# Altium schematic sheet SCH_RESETDAY.SchDoc
size A4; SheetNumber: 2; SheetTotal: 3
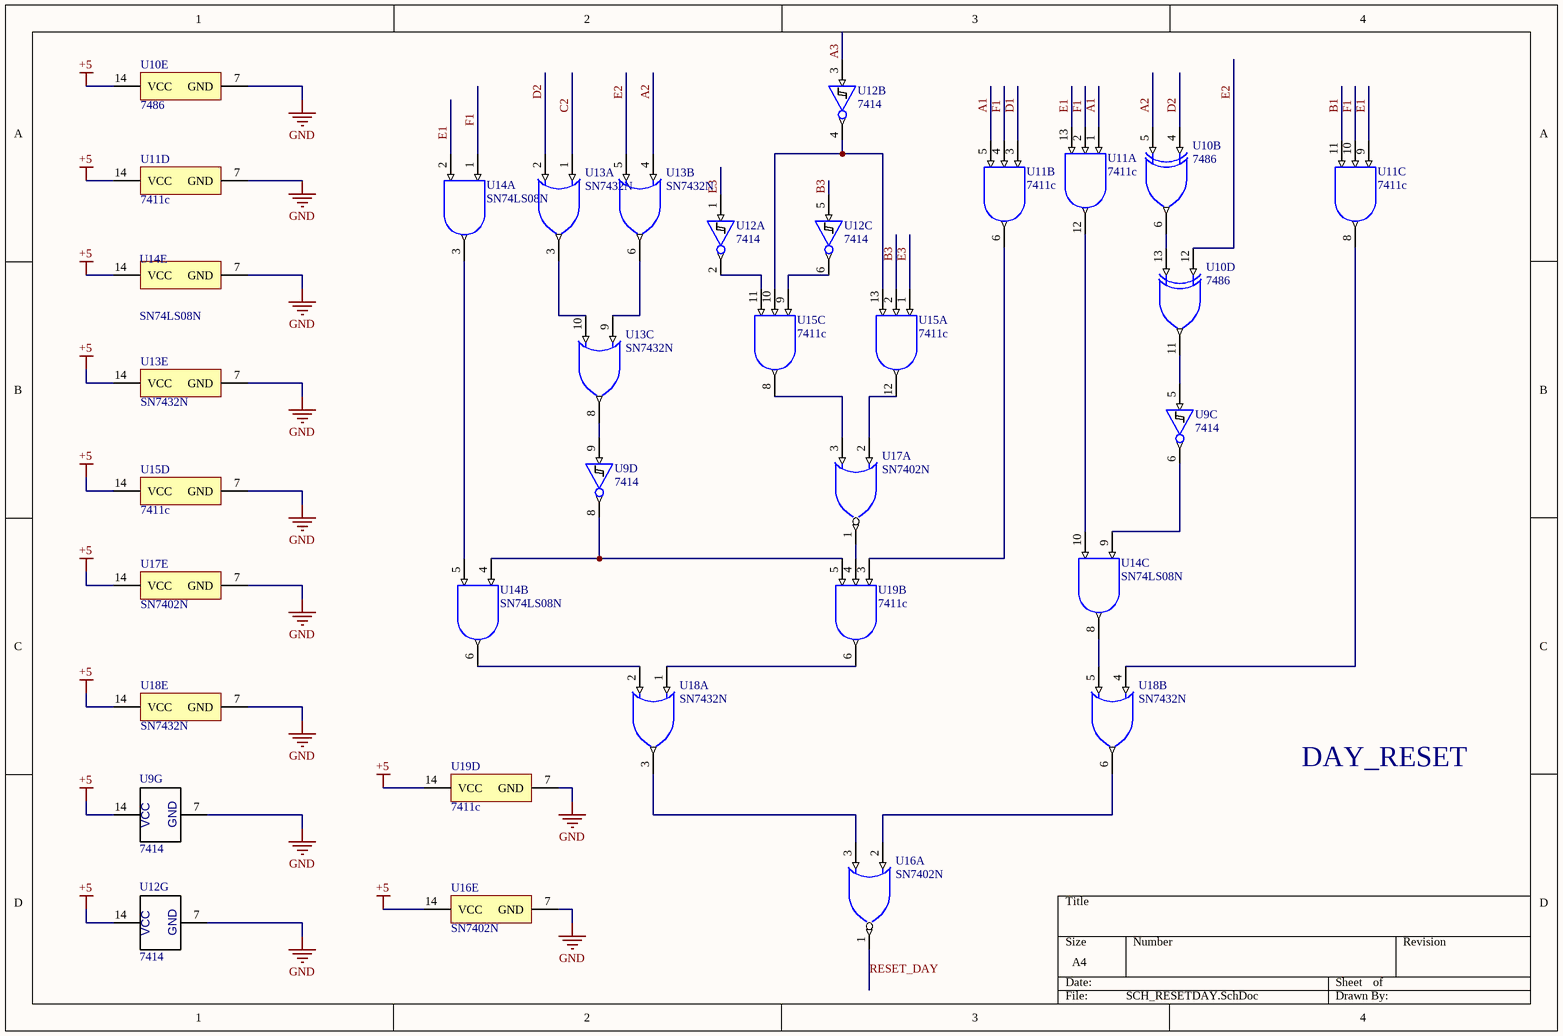
[diagram p0: SCH_RESETDAY.SchDoc]

## Parts
U9  7414  [DIP14]  (parts C,D,G of 7)
U10  7486  [N0014A]  (parts B,D,E of 5)
U11  7411c  [N0014A]  (parts A,B,C,D of 4)
U12  7414  [DIP14]  (parts A,B,C,G of 7)
U13  SN7432N  [N0014A]  (parts A,B,C,E of 5)
U14  SN74LS08N  [N0014A]  (parts A,B,C,E of 5)
U15  7411c  [N0014A]  (parts A,C,D of 4)
U16  SN7402N  [N0014A]  (parts A,E of 5)
U17  SN7402N  [N0014A]  (parts A,E of 5)
U18  SN7432N  [N0014A]  (parts A,B,E of 5)
U19  7411c  [N0014A]  (parts B,D of 4)

## Nets
+5: U9.14(VCC) U10.14(VCC) U11.14(VCC) U12.14(VCC) U13.14(VCC) U14.14(VCC) U15.14(VCC) U16.14(VCC) U17.14(VCC) U18.14(VCC) U19.14(VCC)
GND: U9.7(GND) U10.7(GND) U11.7(GND) U12.7(GND) U13.7(GND) U14.7(GND) U15.7(GND) U16.7(GND) U17.7(GND) U18.7(GND) U19.7(GND)
A1: U11.1(1A) U11.5(2C)
A2: U10.5(2B) U13.4(2A)
A3: U12.3(A)
B1: U11.11(3C)
B3: U12.5(A) U15.2(1B)
C2: U13.1(1A)
D1: U11.3(2A)
D2: U10.4(2A) U13.2(1B)
E1: U11.9(3A) U11.13(1C) U14.2(1B)
E2: U10.12(4A) U13.5(2B)
E3: U12.1(A) U15.1(1A)
F1: U11.2(1B) U11.4(2B) U11.10(3B) U14.1(1A)
RESET_DAY: U16.1(1Y)
NetU9_5: U9.5(A) U10.11(4Y)
NetU9_6: U9.6(Y) U14.9(3A)
NetU9_8: U9.8(Y) U14.4(2A) U19.5(2C)
NetU9_9: U9.9(A) U13.8(3Y)
NetU10_6: U10.6(2Y) U10.13(4B)
NetU11_6: U11.6(2Y) U19.3(2A)
NetU11_8: U11.8(3Y) U18.4(2A)
NetU11_12: U11.12(1Y) U14.10(3B)
NetU12_2: U12.2(Y) U15.11(3C)
NetU12_4: U12.4(Y) U15.10(3B) U15.13(1C)
NetU12_6: U12.6(Y) U15.9(3A)
NetU13_3: U13.3(1Y) U13.10(3B)
NetU13_6: U13.6(2Y) U13.9(3A)
NetU14_3: U14.3(1Y) U14.5(2B)
NetU14_6: U14.6(2Y) U18.2(1B)
NetU14_8: U14.8(3Y) U18.5(2B)
NetU15_8: U15.8(3Y) U17.3(1B)
NetU15_12: U15.12(1Y) U17.2(1A)
NetU16_2: U16.2(1A) U18.6(2Y)
NetU16_3: U16.3(1B) U18.3(1Y)
NetU17_1: U17.1(1Y) U19.4(2B)
NetU18_1: U18.1(1A) U19.6(2Y)

## Notes on the sheet
- DAY_RESET

## Library data of the parts
U9 U12 = 7414: IC, M74HC04M, Hex Inverter, SO-14; Text Field1: ST; Text Field2: M74HC04M1R; Text Field3: Mouser; Text Field4: 511-M74HC04M; Text Field6: .22; Text Field5: SO-14; NI?: *; O?: *; Section:: *
U10 = 7486: High Speed CMOS Logic Quad 2-Input Exclusive-OR Gates, N0014A, TUBE; Manufacturer: Texas Instruments; Generic Part Number: CD74HC86; tpd @ Nom Voltage(Max)(ns): 30; Rating: Catalog; F @ Nom Voltage(Max)(Mhz): 70; VCC(Max)(V): 6; ICC @ Nom Voltage(Max)(mA): 0.02; VCC(Min)(V): 2; Voltage(Nom)(V): 5; Technology Family: HC; Schmitt Trigger: No; Output Drive (IOL/IOH)(Max)(mA): 5.2/-5.2; Bits(#): 4; Output Type: CMOS; DatasheetVersion: SCHS137D; Input Type: CMOS; PackageReference: N0014A; Operating Temperature Range(C): -55 to 125
U11 U15 U19 = 7411c: High Speed CMOS Logic Triple 3-Input AND Gates, N0014A, TUBE; Generic Part Number: CD74HC11; Manufacturer: Texas Instruments; tpd @ Nom Voltage(Max)(ns): 25; VCC(Max)(V): 6; Rating: Catalog; Technology Family: HC; Schmitt Trigger: No; ICC @ Nom Voltage(Max)(mA): 0.02; Bits(#): 3; Voltage(Nom)(V): 5; Output Drive (IOL/IOH)(Max)(mA): -5.2/5.2; VCC(Min)(V): 2; F @ Nom Voltage(Max)(Mhz): 70; DatasheetVersion: SCHS273E; Input Type: CMOS; PackageReference: N0014A; Output Type: CMOS; Operating Temperature Range(C): -55 to 125
U13 U18 = CMP-1573-00140-3: Quad 2-input positive-OR gates, N0014A, TUBE; Manufacturer: Texas Instruments; Generic Part Number: SN7432; VCC(Max)(V): 5.25; Voltage(Nom)(V): 5; VCC(Min)(V): 4.75; F @ Nom Voltage(Max)(Mhz): 100; Output Type: TTL; Output Drive (IOL/IOH)(Max)(mA): 0.8/-16; ICC @ Nom Voltage(Max)(mA): 0.038; Bits(#): 4; tpd @ Nom Voltage(Max)(ns): 22; Rating: Catalog; PackageVersion: http://www.ti.com/lit/ml/mpdi002c/mpdi002c.pdf; Operating Temperature Range(C): 0 to 70; DatasheetVersion: SDLS100; Code_JEDEC: MS-001; Input Type: TTL; PackageReference: N0014A
U14 = CMP-0777-00259-3: Quadruple 2-Input Positive-AND Gates, N0014A, TUBE; Manufacturer: Texas Instruments; VCC(Max)(V): 5.25; ICC @ Nom Voltage(Max)(mA): 0.021; VCC(Min)(V): 4.75; tpd @ Nom Voltage(Max)(ns): 25; Rating: Catalog; Output Type: TTL; Bits(#): 4; Schmitt Trigger: No; Voltage(Nom)(V): 5; Technology Family: LS; F @ Nom Voltage(Max)(Mhz): 35; Output Drive (IOL/IOH)(Max)(mA): -0.8/16; PackageReference: N0014A; DatasheetVersion: SDLS033; Input Type: TTL; Operating Temperature Range(C): 0 to 70; Generic Part Number: SN74LS08
U16 U17 = CMP-0806-00203-3: Quad 2-input Positive-NOR gates, N0014A, TUBE; Generic Part Number: SN7402; Manufacturer: Texas Instruments; Input Type: TTL; F @ Nom Voltage(Max)(Mhz): 75; VCC(Max)(V): 5.25; VCC(Min)(V): 4.75; Voltage(Nom)(V): 5; Rating: Catalog; Bits(#): 4; ICC @ Nom Voltage(Max)(mA): 0.027; Output Drive (IOL/IOH)(Max)(mA): 0.8/-16; tpd @ Nom Voltage(Max)(ns): 22; Code_JEDEC: MS-001; PackageVersion: http://www.ti.com/lit/ml/mpdi002c/mpdi002c.pdf; Operating Temperature Range(C): 0 to 70; Output Type: TTL; PackageReference: N0014A; DatasheetVersion: SDLS027